# EAGLE design 555_pumpkin (EAGLE 5.11)
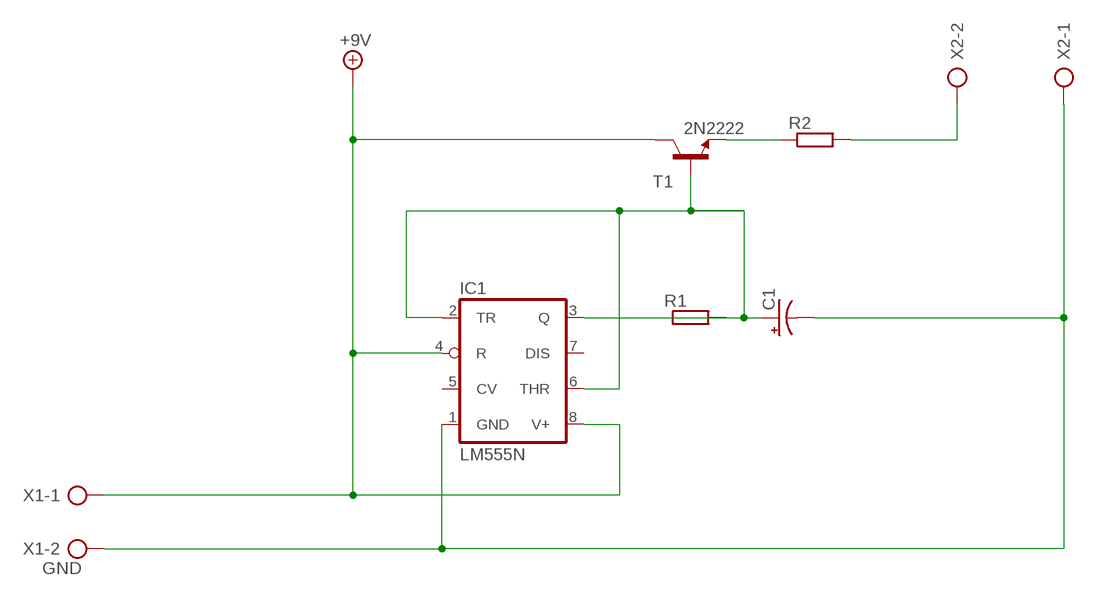
[diagram p0: schematic, sheet 1]

## Parts
C1  CPOL-USE5-5  [E5-5]
IC1  LM555N  [DIL08-ROUND]
R1  R-EU_0309/V  [0309V]
R2  R-EU_0309/V  [0309V]
T1  2N2222  [TO92-EBC-OVAL]
X1  GND  AK300/2  [AK300/2]
X2  AK300/2  [AK300/2]

## Nets
+9V: IC1.4(R) IC1.8(V+) T1.C X1.1
N$1: C1.+ IC1.2(TR) IC1.3(Q) IC1.6(THR) R1.1 R1.2 T1.B
N$2: R2.1 T1.E
N$3: R2.2 X2.2
N$4: C1.- IC1.1(GND) X1.2
Unconnected: IC1.5(CV) IC1.7(DIS) X2.1

## Library data of the parts
C1 = adafruit:CPOL-US: POLARIZED CAPACITOR, American symbol
IC1 = adafruit:*555: TIMER Changed DIP package to have round (not oval) pin pads http://www.ladyada.net/library/pcb/eaglelibrary.html
R1 R2 = resistor:R-EU_: RESISTOR, European symbol
T1 = adafruit:2N2222: NPN TRANSISTOR Big oval pads
X1 X2 = con-ptr500:AK300/2: CONNECTOR; OC_FARNELL: unknown; OC_NEWARK: unknown

## Board
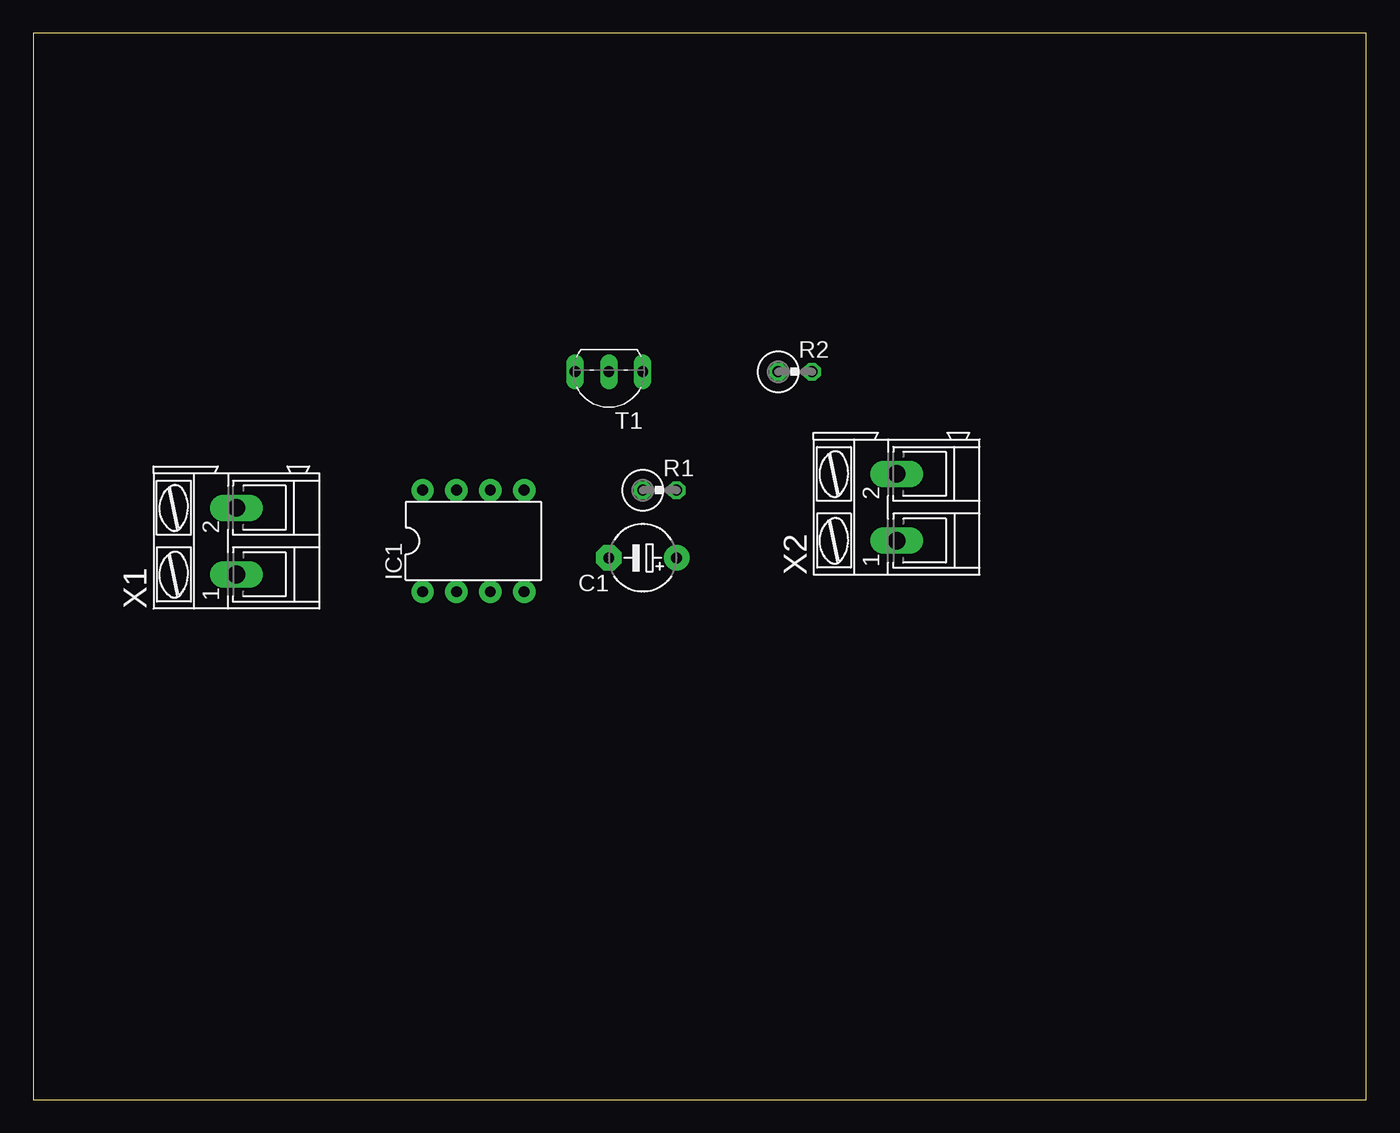
[diagram p1: board, top side]
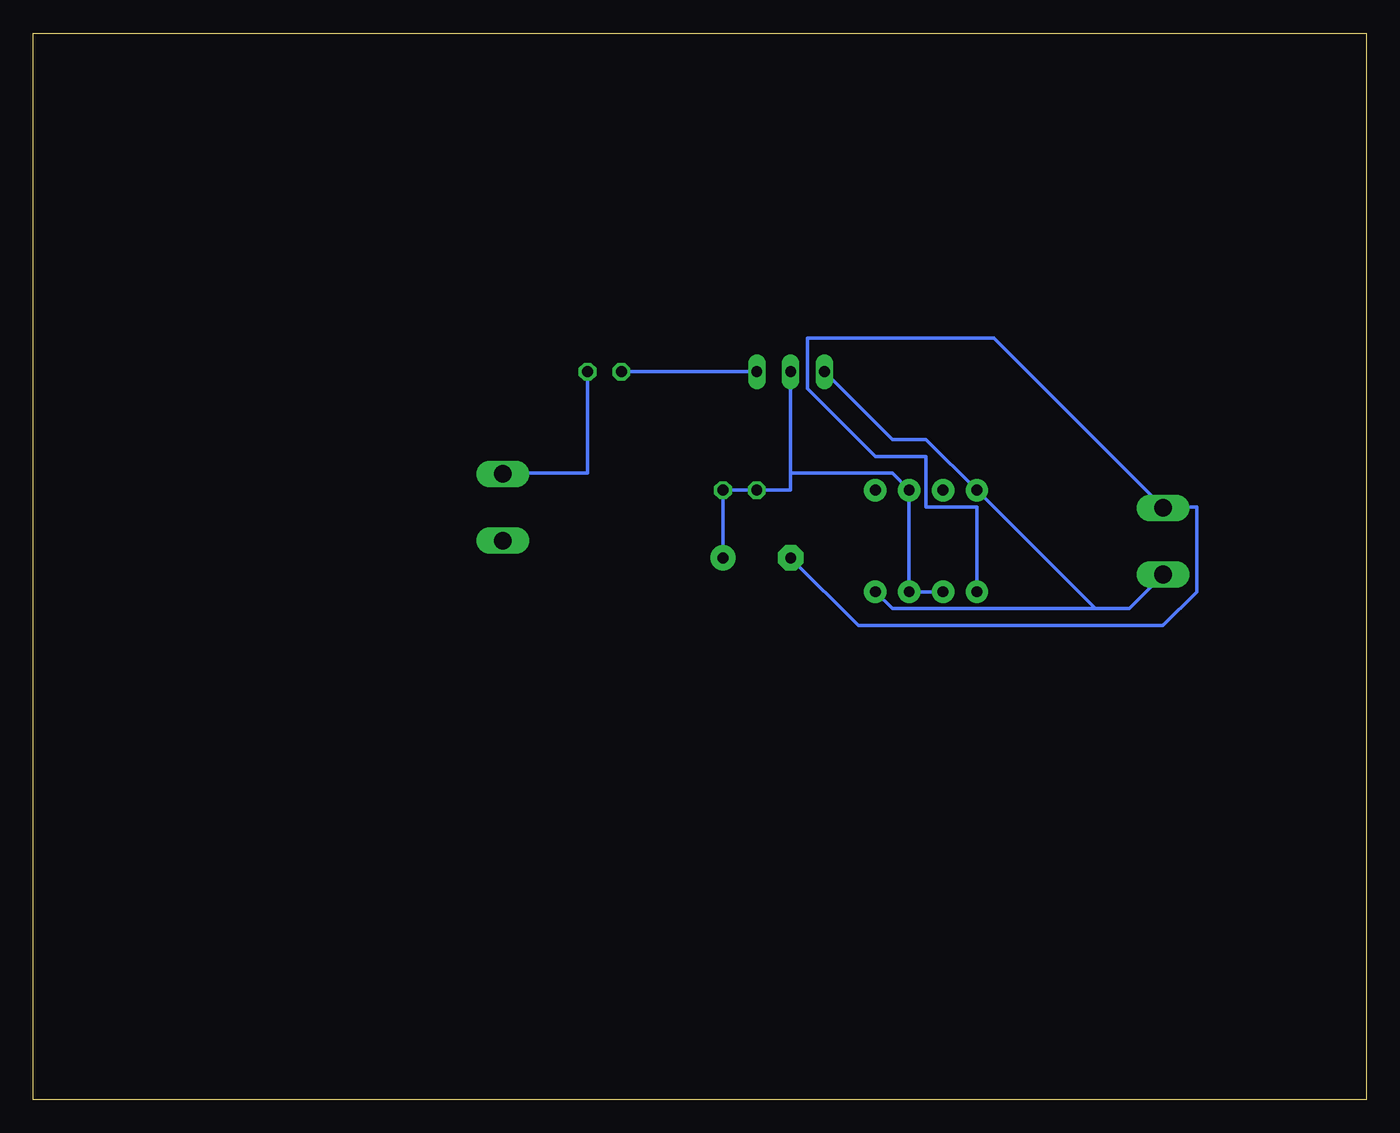
[diagram p2: board, bottom side, seen from below]

Size 100 x 80 mm. Coordinates in mm from the lower left corner, seen from the top.
Outline: 0,0 100,0 100,80 0,80 0,0
Copper layers (1*16): Top 0.035mm / dielectric 1.5mm / Bottom 0.035mm
Design rules "default": minimum track width 10mil, minimum drill 24mil, track to track 8mil, track to pad 8mil, pad to pad 8mil, via to via 8mil, smd to smd 8mil, copper to edge 40mil, drill to drill 8mil, minimum pad ring 10mil, minimum via ring 8mil, stop-mask expansion 4mil, vias tented up to drill 0mil, thermal gap 10mil

### Footprints (pad centres in the part's own frame; a part is rotated, then mirrored left to right if it is on the bottom)
E5-5 = drill 0.813 pad 1.905 round: + -2.54,0 | drill 0.813 pad 1.905 octagon: - 2.54,0
DIL08-ROUND = drill 0.813 pad 1.676 round: 1 -3.81,-3.81; 2 -1.27,-3.81; 3 1.27,-3.81; 4 3.81,-3.81; 5 3.81,3.81; 6 1.27,3.81; 7 -1.27,3.81; 8 -3.81,3.81
0309V = drill 0.813 octagon: 1 -1.27,0; 2 1.27,0
TO92-EBC-OVAL = drill 0.813 long: B 0,-1.27; C 2.54,-1.27; E -2.54,-1.27
AK300/2 = drill 1.321 long: 1 -2.515,0; 2 2.489,0

### Placement (x,y rotation side)
C1  45.72,40.64 180 top
IC1  33.02,41.91 0 top
R1  46.99,45.72 0 top
R2  57.15,54.61 0 top
T1  43.18,53.34 180 top
X1  15.24,41.91 90 top
X2  64.77,44.45 90 top

### Tracks (layer width: path | path; a pad name or v marks a point on that pad's centre or on a via)
+9V
  Bottom 0.254: T1.C 35.56,49.53 33.02,49.53 IC1.8 20.32,36.83 | IC1.4 35.56,36.83 20.32,36.83 | 20.32,36.83 17.78,36.83 15.24,39.37 X1.1
N$1
  Top 0.254: R1.1 R1.2
  Bottom 0.254: IC1.2 IC1.3 IC1.6 35.56,46.99 43.18,46.99 | 43.18,46.99 43.18,45.72 R1.1 R1.2 C1.+ | 43.18,46.99 T1.B
N$2
  Bottom 0.254: T1.E R2.1
N$3
  Bottom 0.254: R2.2 58.42,46.99 64.77,46.99 X2.2
N$4
  Bottom 0.254: IC1.1 29.21,44.45 33.02,44.45 33.02,48.26 36.83,48.26 41.91,53.34 41.91,57.15 27.94,57.15 15.24,44.45 | C1.- 38.1,35.56 15.24,35.56 12.7,38.1 12.7,44.45 15.24,44.45 | 15.24,44.45 X1.2